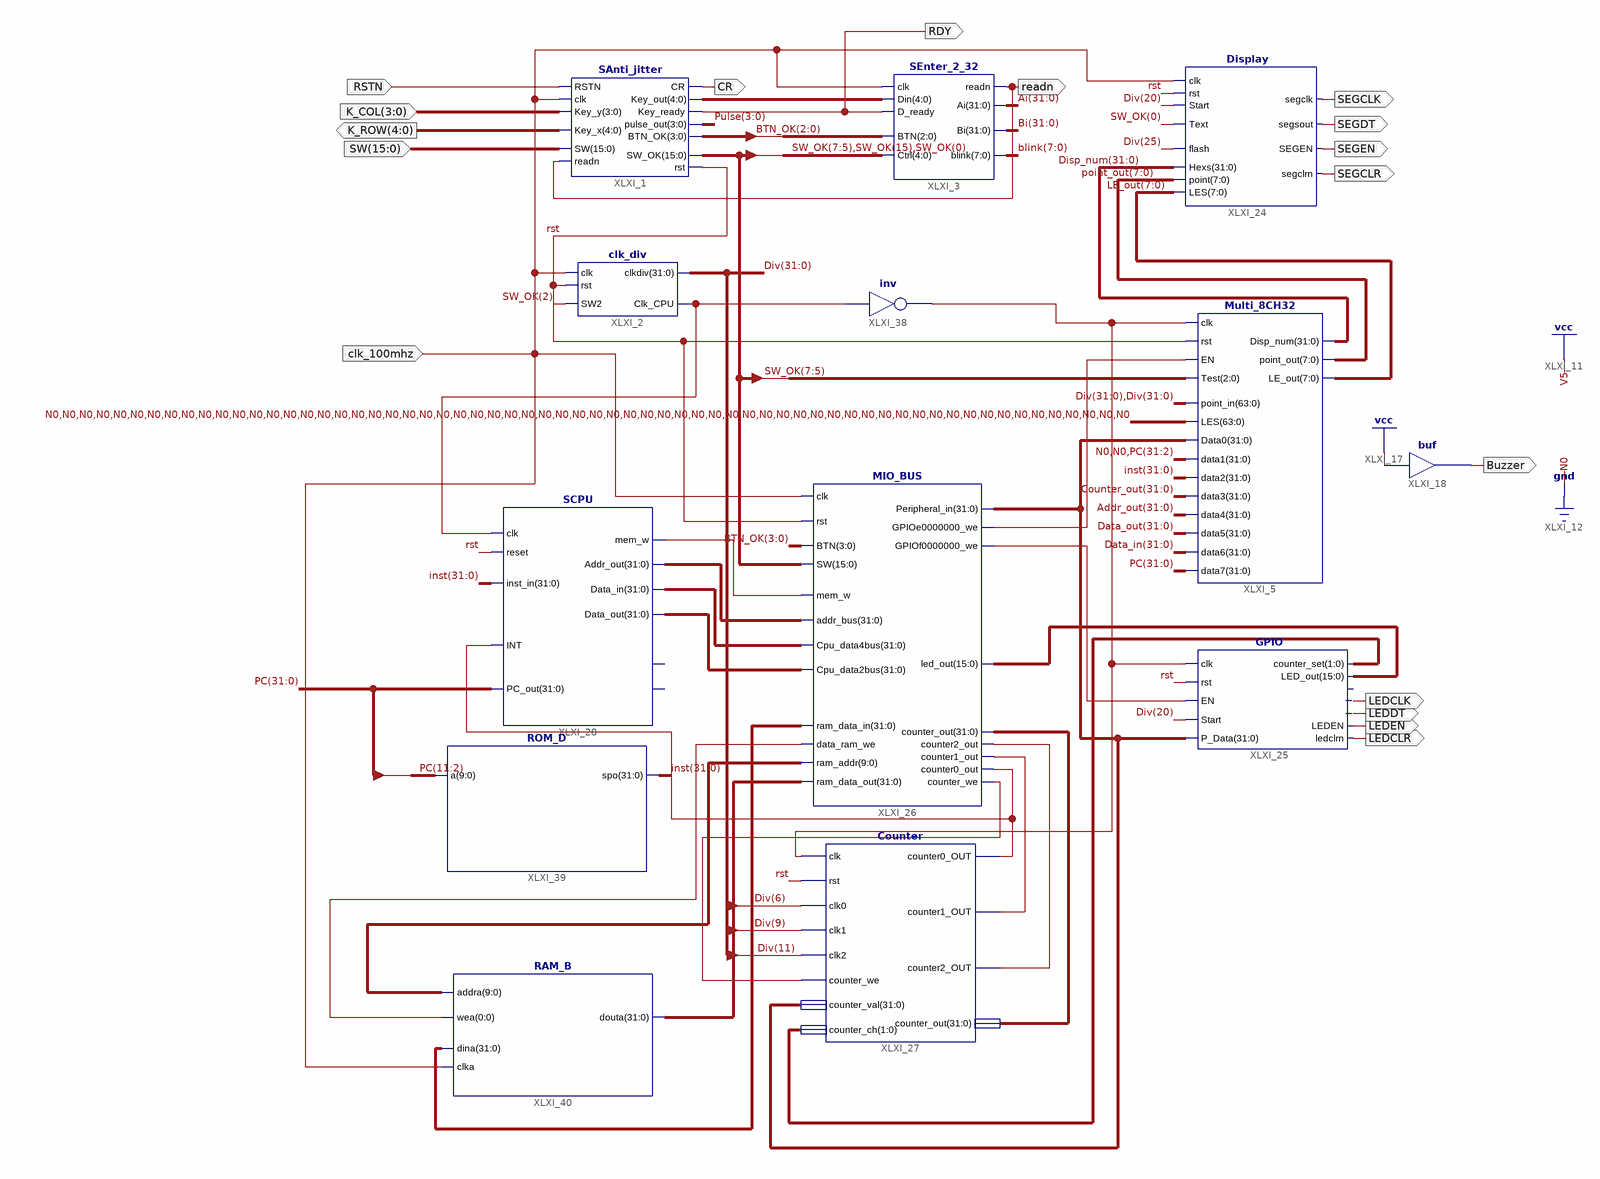
[diagram p0: schematic sheet 1]
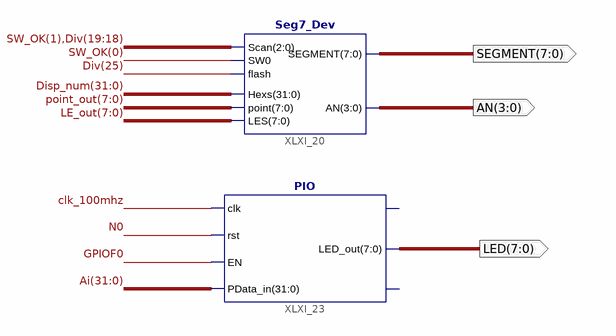
[diagram p1: schematic sheet 2]
// Xilinx ISE schematic Top.sch (kintex7) as structural Verilog: 15 symbols, 20 ports
module Top (
  input  RSTN,
  input  [3:0] K_COL,
  input  [15:0] SW,
  input  clk_100mhz,
  output [4:0] K_ROW,
  output CR,
  output RDY,
  output readn,
  output SEGCLK,
  output SEGDT,
  output SEGEN,
  output SEGCLR,
  output Buzzer,
  output [7:0] SEGMENT,
  output [3:0] AN,
  output [7:0] LED,
  output LEDCLR,
  output LEDEN,
  output LEDDT,
  output LEDCLK
);

  wire GPIOF0, rst, XLXN_97, XLXN_98, XLXN_150, XLXN_154, XLXN_169, XLXN_192, XLXN_193, XLXN_199, XLXN_200;
  wire [0:0] XLXN_160;
  wire [1:0] XLXN_140;
  wire [3:0] BTN_OK, Pulse;
  wire [4:0] XLXN_9;
  wire [7:0] blink, LE_out, point_out;
  wire [9:0] XLXN_162;
  wire [15:0] SW_OK, XLXN_141;
  wire [31:0] Addr_out, Ai, Bi, Counter_out, CPU2IO, Data_in, Data_out, Disp_num, Div, inst, PC, XLXN_99,
       XLXN_151, XLXN_152, XLXN_153, XLXN_158, XLXN_164;

  SAnti_jitter XLXI_1 (
    .SW(SW), .readn(readn), .Key_y(K_COL), .Key_x(K_ROW), .RSTN(RSTN), .clk(clk_100mhz), .Key_out(XLXN_9),
    .Key_ready(RDY), .CR(CR), .rst(rst), .SW_OK(SW_OK), .pulse_out(Pulse), .BTN_OK(BTN_OK));
  clk_div XLXI_2 (.rst(rst), .clk(clk_100mhz), .SW2(SW_OK[2]), .clkdiv(Div), .Clk_CPU(XLXN_199));
  Multi_8CH32 XLXI_5 (
    .Test(SW_OK[7:5]), .point_in({Div, Div}), .EN(XLXN_193), .clk(XLXN_200), .rst(rst), .LES({64{1'b0}}),
    .Data0(CPU2IO), .data1({2'b00, PC[31:2]}), .data2(inst), .data3(Counter_out), .data4(Addr_out),
    .data5(Data_out), .data6(Data_in), .data7(PC), .point_out(point_out), .LE_out(LE_out), .Disp_num(Disp_num));
  SEnter_2_32 XLXI_3 (
    .readn(readn), .Ai(Ai), .Bi(Bi), .blink(blink), .Din(XLXN_9), .D_ready(RDY), .clk(clk_100mhz),
    .Ctrl({SW_OK[7:5], SW_OK[15], SW_OK[0]}), .BTN(BTN_OK[2:0]));
  buf XLXI_18 (Buzzer, 1'b1);
  Seg7_Dev XLXI_20 (
    .LES(LE_out), .Scan({SW_OK[1], Div[19:18]}), .SEGMENT(SEGMENT), .AN(AN), .point(point_out),
    .flash(Div[25]), .SW0(SW_OK[0]), .Hexs(Disp_num));
  PIO XLXI_23 (.clk(clk_100mhz), .rst(1'b0), .EN(GPIOF0), .PData_in(Ai), .LED_out(LED));  // open: GPIOf0, counter_set
  Display XLXI_24 (
    .LES(LE_out), .SEGEN(SEGEN), .segsout(SEGDT), .segclrn(SEGCLR), .point(point_out), .Hexs(Disp_num),
    .Text(SW_OK[0]), .flash(Div[25]), .segclk(SEGCLK), .clk(clk_100mhz), .rst(rst), .Start(Div[20]));
  MIO_BUS XLXI_26 (
    .rst(rst), .clk(clk_100mhz), .mem_w(XLXN_150), .addr_bus(XLXN_151), .Cpu_data4bus(XLXN_152),
    .Cpu_data2bus(XLXN_153), .ram_data_out(XLXN_164), .ram_addr(XLXN_162), .data_ram_we(XLXN_160[0]),
    .ram_data_in(XLXN_158), .counter_out(XLXN_99), .counter2_out(XLXN_98), .counter1_out(XLXN_97),
    .counter0_out(XLXN_154), .counter_we(XLXN_169), .BTN(BTN_OK), .SW(SW_OK), .led_out(XLXN_141),
    .Peripheral_in(CPU2IO), .GPIOe0000000_we(XLXN_193), .GPIOf0000000_we(XLXN_192));
  Counter XLXI_27 (
    .clk(XLXN_200), .rst(rst), .clk0(Div[6]), .clk1(Div[9]), .clk2(Div[11]), .counter_we(XLXN_169),
    .counter_val(CPU2IO), .counter_ch(XLXN_140), .counter0_OUT(XLXN_154), .counter1_OUT(XLXN_97),
    .counter2_OUT(XLXN_98), .counter_out(XLXN_99));
  SCPU XLXI_28 (
    .clk(XLXN_199), .reset(rst), .inst_in(inst), .INT(XLXN_154), .Addr_out(XLXN_151), .mem_w(XLXN_150),
    .Data_out(XLXN_153), .Data_in(XLXN_152), .PC_out(PC));  // open: CPU_MIO, MIO_ready
  GPIO XLXI_25 (
    .clk(XLXN_200), .P_Data(CPU2IO), .rst(rst), .EN(XLXN_192), .Start(Div[20]), .ledclk(LEDCLK),
    .LED_out(XLXN_141), .counter_set(XLXN_140), .ledclrn(LEDCLR), .LEDEN(LEDEN), .ledsout(LEDDT));  // open: GPIOf0
  not XLXI_38 (XLXN_200, XLXN_199);
  ROM_D XLXI_39 (.a(PC[11:2]), .spo(inst));
  RAM_B XLXI_40 (.addra(XLXN_162), .clka(clk_100mhz), .wea(XLXN_160[0]), .dina(XLXN_158), .douta(XLXN_164));
endmodule
